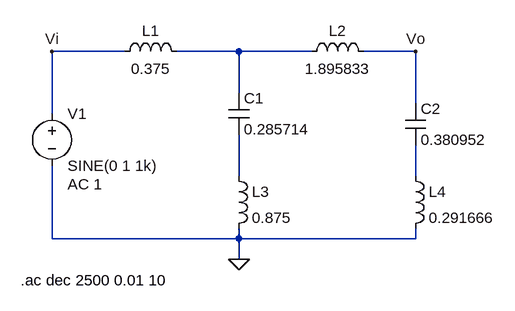
[diagram p0: schematic Ex9.asc]
Ex9.asc, the LTspice schematic file:
Version 4
SHEET 1 880 680
WIRE 80 64 -32 64
WIRE 256 64 160 64
WIRE 368 64 256 64
WIRE 528 64 448 64
WIRE 256 128 256 64
WIRE 528 144 528 64
WIRE -32 160 -32 64
WIRE 256 256 256 192
WIRE 528 256 528 208
WIRE -32 352 -32 240
WIRE 256 352 256 336
WIRE 256 352 -32 352
WIRE 528 352 528 336
WIRE 528 352 256 352
WIRE 256 384 256 352
FLAG 256 384 0
FLAG 528 64 Vo
FLAG -32 64 Vi
SYMBOL voltage -32 144 R0
WINDOW 123 24 124 Left 2
WINDOW 39 0 0 Left 0
SYMATTR Value2 AC 1
SYMATTR InstName V1
SYMATTR Value SINE(0 1 1k)
SYMBOL ind 64 80 R270
WINDOW 0 32 56 VTop 2
WINDOW 3 5 56 VBottom 2
SYMATTR InstName L1
SYMATTR Value 0.375
SYMBOL ind 352 80 R270
WINDOW 0 32 56 VTop 2
WINDOW 3 5 56 VBottom 2
SYMATTR InstName L2
SYMATTR Value 1.895833
SYMBOL ind 240 240 R0
SYMATTR InstName L3
SYMATTR Value 0.875
SYMBOL ind 512 240 R0
SYMATTR InstName L4
SYMATTR Value 0.291666
SYMBOL cap 240 128 R0
SYMATTR InstName C1
SYMATTR Value 0.285714
SYMBOL cap 512 144 R0
SYMATTR InstName C2
SYMATTR Value 0.380952
TEXT -80 416 Left 2 !.ac dec 2500 0.01 10

The netlist it stands for:
* Ex9.asc
V1 Vi 0 SINE(0 1 1k) AC 1
L1 Vi N001 0.375
L2 N001 Vo 1.895833
L3 N002 0 0.875
L4 N003 0 0.291666
C1 N001 N002 0.285714
C2 Vo N003 0.380952
.ac dec 2500 0.01 10
.backanno
.end